# EAGLE design PiHatSandwich-v2 (EAGLE 7.4.0)
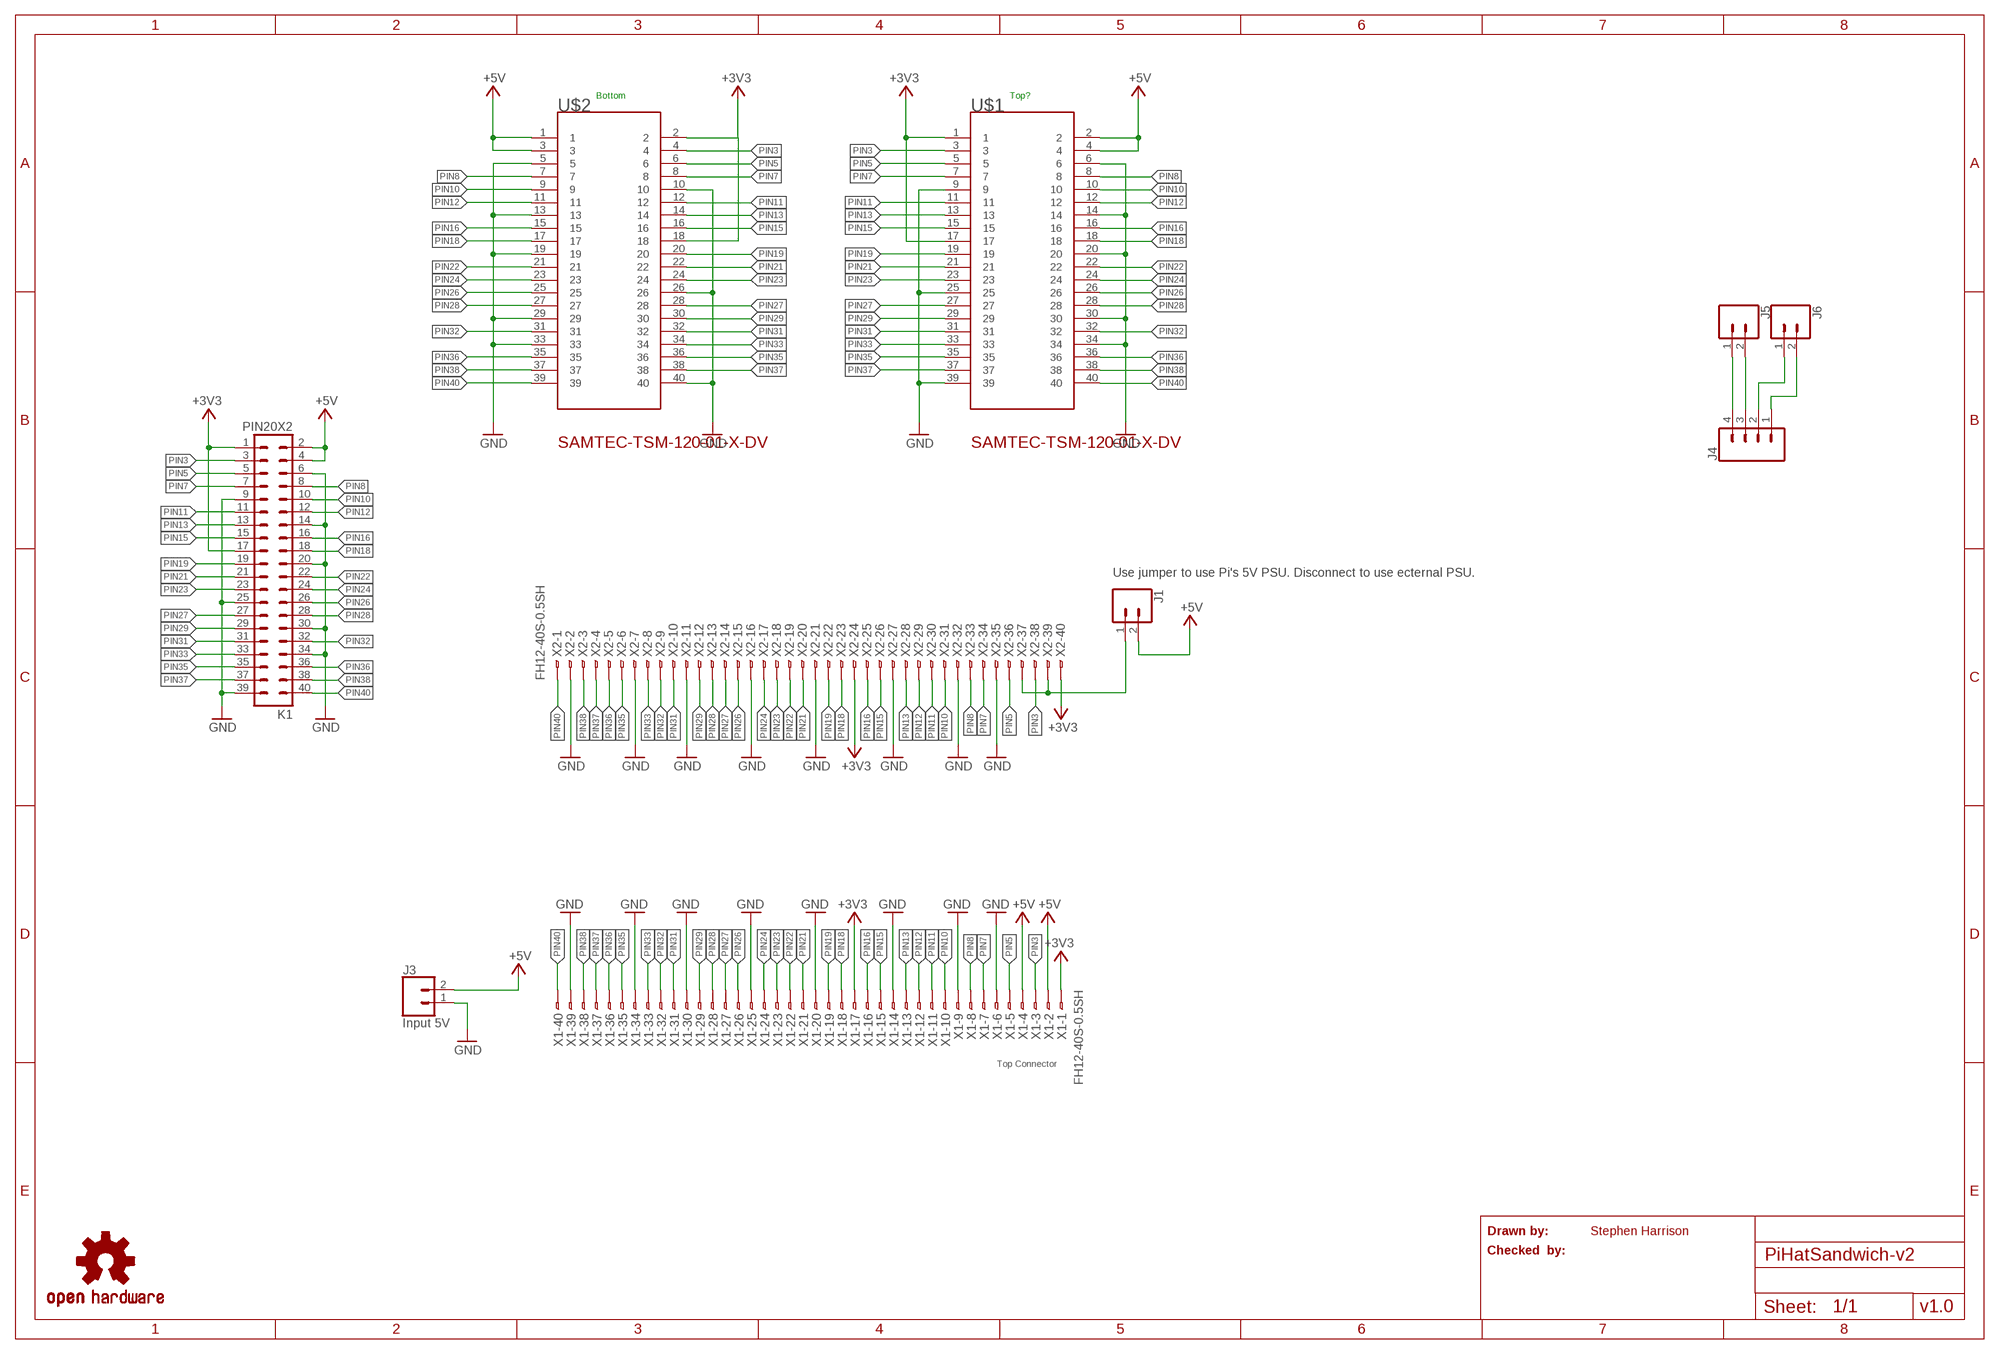
[diagram p0: schematic, sheet 1]

## Parts
J1  CONN_02  [1X02]
J3  Input 5V  CONN_02POLAR  [MOLEX-1X2]
J4  CONN_04POLAR  [MOLEX-1X4]
J5  CONN_02  [1X02]
J6  CONN_02  [1X02]
K1  PIN20X2  [PIN_20X2]
LOGO1  OSHW-LOGOL  [OSHW-LOGO-L]
U$1  SAMTEC-TSM-120-01-X-DVJ  [SAMTEC-TSM-120-01-X-DV]
U$2  SAMTEC-TSM-120-01-X-DVJ  [SAMTEC-TSM-120-01-X-DV]
X1  FH12-40S-0.5SH  [FH12-40S-0.5SH]
X2  FH12-40S-0.5SH  [FH12-40S-0.5SH]

## Nets
+3V3: K1.1 K1.17 U$1.1 U$1.17 U$2.2 U$2.18 X1.1 X1.17 X2.24 X2.40
+5V: J1.2 J3.2 K1.2 K1.4 U$1.2 U$1.4 U$2.1 U$2.3 X1.2 X1.4
GND: J3.1 K1.6 K1.9 K1.14 K1.20 K1.25 K1.30 K1.34 K1.39 U$1.6 U$1.9 U$1.14 U$1.20 U$1.25 U$1.30 U$1.34 U$1.39 U$2.5 U$2.10 U$2.13 U$2.19 U$2.26 U$2.29 U$2.33 U$2.40 X1.6 X1.9 X1.14 X1.20 X1.25 X1.30 X1.34 X1.39 X2.2 X2.7 X2.11 X2.16 X2.21 X2.27 X2.32 X2.35
N$2: J1.1 X2.37 X2.39
N$4: J4.4 J5.1
N$5: J4.3 J5.2
N$6: J4.1 J6.2
N$7: J4.2 J6.1
PIN3: K1.3 U$1.3 U$2.4 X1.3 X2.38
PIN5: K1.5 U$1.5 U$2.6 X1.5 X2.36
PIN7: K1.7 U$1.7 U$2.8 X1.7 X2.34
PIN8: K1.8 U$1.8 U$2.7 X1.8 X2.33
PIN10: K1.10 U$1.10 U$2.9 X1.10 X2.31
PIN11: K1.11 U$1.11 U$2.12 X1.11 X2.30
PIN12: K1.12 U$1.12 U$2.11 X1.12 X2.29
PIN13: K1.13 U$1.13 U$2.14 X1.13 X2.28
PIN15: K1.15 U$1.15 U$2.16 X1.15 X2.26
PIN16: K1.16 U$1.16 U$2.15 X1.16 X2.25
PIN18: K1.18 U$1.18 U$2.17 X1.18 X2.23
PIN19: K1.19 U$1.19 U$2.20 X1.19 X2.22
PIN21: K1.21 U$1.21 U$2.22 X1.21 X2.20
PIN22: K1.22 U$1.22 U$2.21 X1.22 X2.19
PIN23: K1.23 U$1.23 U$2.24 X1.23 X2.18
PIN24: K1.24 U$1.24 U$2.23 X1.24 X2.17
PIN26: K1.26 U$1.26 U$2.25 X1.26 X2.15
PIN27: K1.27 U$1.27 U$2.28 X1.27 X2.14
PIN28: K1.28 U$1.28 U$2.27 X1.28 X2.13
PIN29: K1.29 U$1.29 U$2.30 X1.29 X2.12
PIN31: K1.31 U$1.31 U$2.32 X1.31 X2.10
PIN32: K1.32 U$1.32 U$2.31 X1.32 X2.9
PIN33: K1.33 U$1.33 U$2.34 X1.33 X2.8
PIN35: K1.35 U$1.35 U$2.36 X1.35 X2.6
PIN36: K1.36 U$1.36 U$2.35 X1.36 X2.5
PIN37: K1.37 U$1.37 U$2.38 X1.37 X2.4
PIN38: K1.38 U$1.38 U$2.37 X1.38 X2.3
PIN40: K1.40 U$1.40 U$2.39 X1.40 X2.1

## Notes on the sheet
- Bottom | Top?
- Use jumper to use Pi's 5V PSU. Disconnect to use ecternal PSU.
- Top Connector
- Drawn by: | Stephen Harrison
- Checked  by:
- v1.0

## Library data of the parts
J1 J5 J6 = SparkFun-Connectors:CONN_02: Multi connection point. Often used as Generic Header-pin footprint for 0.1 inch spaced/style header connections On any of the 0.1 inch spaced packages, you can populate with these: Break Away Headers - Straight <https://www.sparkfun.com/products/116> (PRT-00116) Break Away Male Headers - Right Angle <https://www.sparkfun.com/products/553> (PRT-00553) Female Headers <https://www.sparkfun.com/products/115> (PRT-00115) Break Away Headers - Machine Pin <https://www.sparkfun.com/products/117> (PRT-00117) Break Away Female Headers - Swiss Machine Pin <https://www.sparkfun.com/products/743> (PRT-00743) For SCREWTERMINALS and SPRING TERMINALS visit here: Screw Terimnals on SparkFun.com <https://www.sparkfun.com/search/results?term=Screw+Terminals> (5mm/3.5mm/2.54mm spacing) This device is also useful as a general connection point to wire up your design to another part of your project. Our various solder wires solder well into these plated through hole pads. Hook-Up Wire - Assortment (Stranded, 22 AWG) <https://www.sparkfun.com/products/11375> (PRT-11375) Hook-Up Wire - Assortment (Solid Core, 22 AWG) <https://www.sparkfun.com/products/11367> (PRT-11367) View the entire wire category on our website here <https://www.sparkfun.com/categories/141> Special notes: Molex polarized connector foot print use with: PRT-08233 with associated crimp pins and housings. 2.54_SCREWTERM for use with PRT-10571. 3.5mm Screw Terminal footprints for PRT-08084 5mm Screw Terminal footprints for use with PRT-08432
J3 = SparkFun-Connectors:CONN_02: Multi connection point. Often used as Generic Header-pin footprint for 0.1 inch spaced/style header connections On any of the 0.1 inch spaced packages, you can populate with these: Break Away Headers - Straight <https://www.sparkfun.com/products/116> (PRT-00116) Break Away Male Headers - Right Angle <https://www.sparkfun.com/products/553> (PRT-00553) Female Headers <https://www.sparkfun.com/products/115> (PRT-00115) Break Away Headers - Machine Pin <https://www.sparkfun.com/products/117> (PRT-00117) Break Away Female Headers - Swiss Machine Pin <https://www.sparkfun.com/products/743> (PRT-00743) For SCREWTERMINALS and SPRING TERMINALS visit here: Screw Terimnals on SparkFun.com <https://www.sparkfun.com/search/results?term=Screw+Terminals> (5mm/3.5mm/2.54mm spacing) This device is also useful as a general connection point to wire up your design to another part of your project. Our various solder wires solder well into these plated through hole pads. Hook-Up Wire - Assortment (Stranded, 22 AWG) <https://www.sparkfun.com/products/11375> (PRT-11375) Hook-Up Wire - Assortment (Solid Core, 22 AWG) <https://www.sparkfun.com/products/11367> (PRT-11367) View the entire wire category on our website here <https://www.sparkfun.com/categories/141> Special notes: Molex polarized connector foot print use with: PRT-08233 with associated crimp pins and housings. 2.54_SCREWTERM for use with PRT-10571. 3.5mm Screw Terminal footprints for PRT-08084 5mm Screw Terminal footprints for use with PRT-08432; SF_ID: PRT-09918
J4 = SparkFun-Connectors:CONN_04: Multi connection point. Often used as Generic Header-pin footprint for 0.1 inch spaced/style header connections On any of the 0.1 inch spaced packages, you can populate with these: Break Away Headers - Straight <https://www.sparkfun.com/products/116> (PRT-00116) Break Away Male Headers - Right Angle <https://www.sparkfun.com/products/553> (PRT-00553) Female Headers <https://www.sparkfun.com/products/115> (PRT-00115) Break Away Headers - Machine Pin <https://www.sparkfun.com/products/117> (PRT-00117) Break Away Female Headers - Swiss Machine Pin <https://www.sparkfun.com/products/743> (PRT-00743) For SCREWTERMINALS and SPRING TERMINALS visit here: Screw Terimnals on SparkFun.com <https://www.sparkfun.com/search/results?term=Screw+Terminals> (5mm/3.5mm/2.54mm spacing) This device is also useful as a general connection point to wire up your design to another part of your project. Our various solder wires solder well into these plated through hole pads. Hook-Up Wire - Assortment (Stranded, 22 AWG) <https://www.sparkfun.com/products/11375> (PRT-11375) Hook-Up Wire - Assortment (Solid Core, 22 AWG) <https://www.sparkfun.com/products/11367> (PRT-11367) View the entire wire category on our website here <https://www.sparkfun.com/categories/141> Special notes: Molex polarized connector foot print use with SKU : PRT-08231 with associated crimp pins and housings. 1MM SMD Version SKU: PRT-10208; PROD_ID: CONN-08186; SF_ID: PRT-08231
K1 = FLYFISH:PIN20X2
LOGO1 = SparkFun-Aesthetics:OSHW-LOGO: Open-Source Hardware (OSHW) Logo This logo indicates the piece of hardware it is found on incorporates a OSHW license and/or adheres to the definition of open source hardware found here: http://freedomdefined.org/OSHW
U$1 U$2 = SAMTEC-TSM-120-01-X-DV:SAMTEC-TSM-120-01-X-DV; AVAILABILITY: Unavailable; DESCRIPTION: Conn Unshrouded Header HDR 40 POS 2.54mm Solder ST SMD Tube; MF: Samtec; MP: TSM-120-01-S-DV-M; PACKAGE: None; PRICE: None
X1 X2 = con-hirose:FH12-40S-0.5S: 0.5mm Pitch Connectors For FPC/FFC Source: Data sheet <http://www.hirose.co.jp/cataloge_hp/e58605370.pdf>; MPN: FH12-40S-0.5SH(55); OC_FARNELL: 1324556; OC_NEWARK: 34M6178

## Board
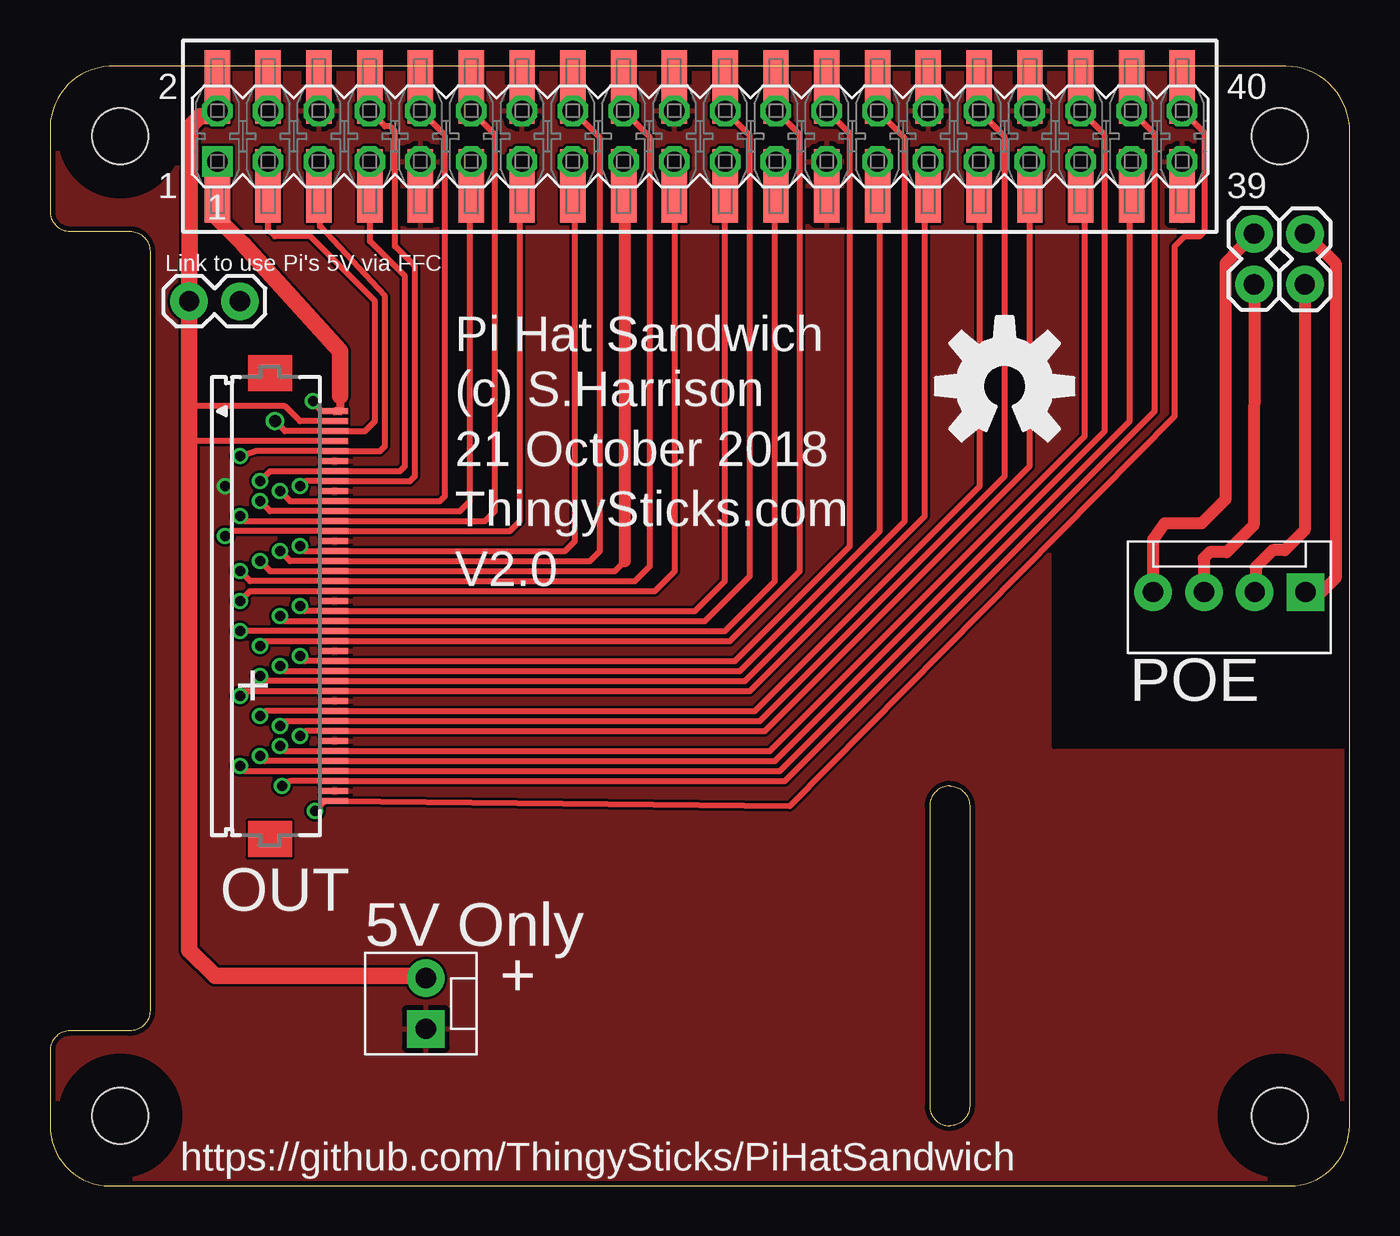
[diagram p1: board, top side]
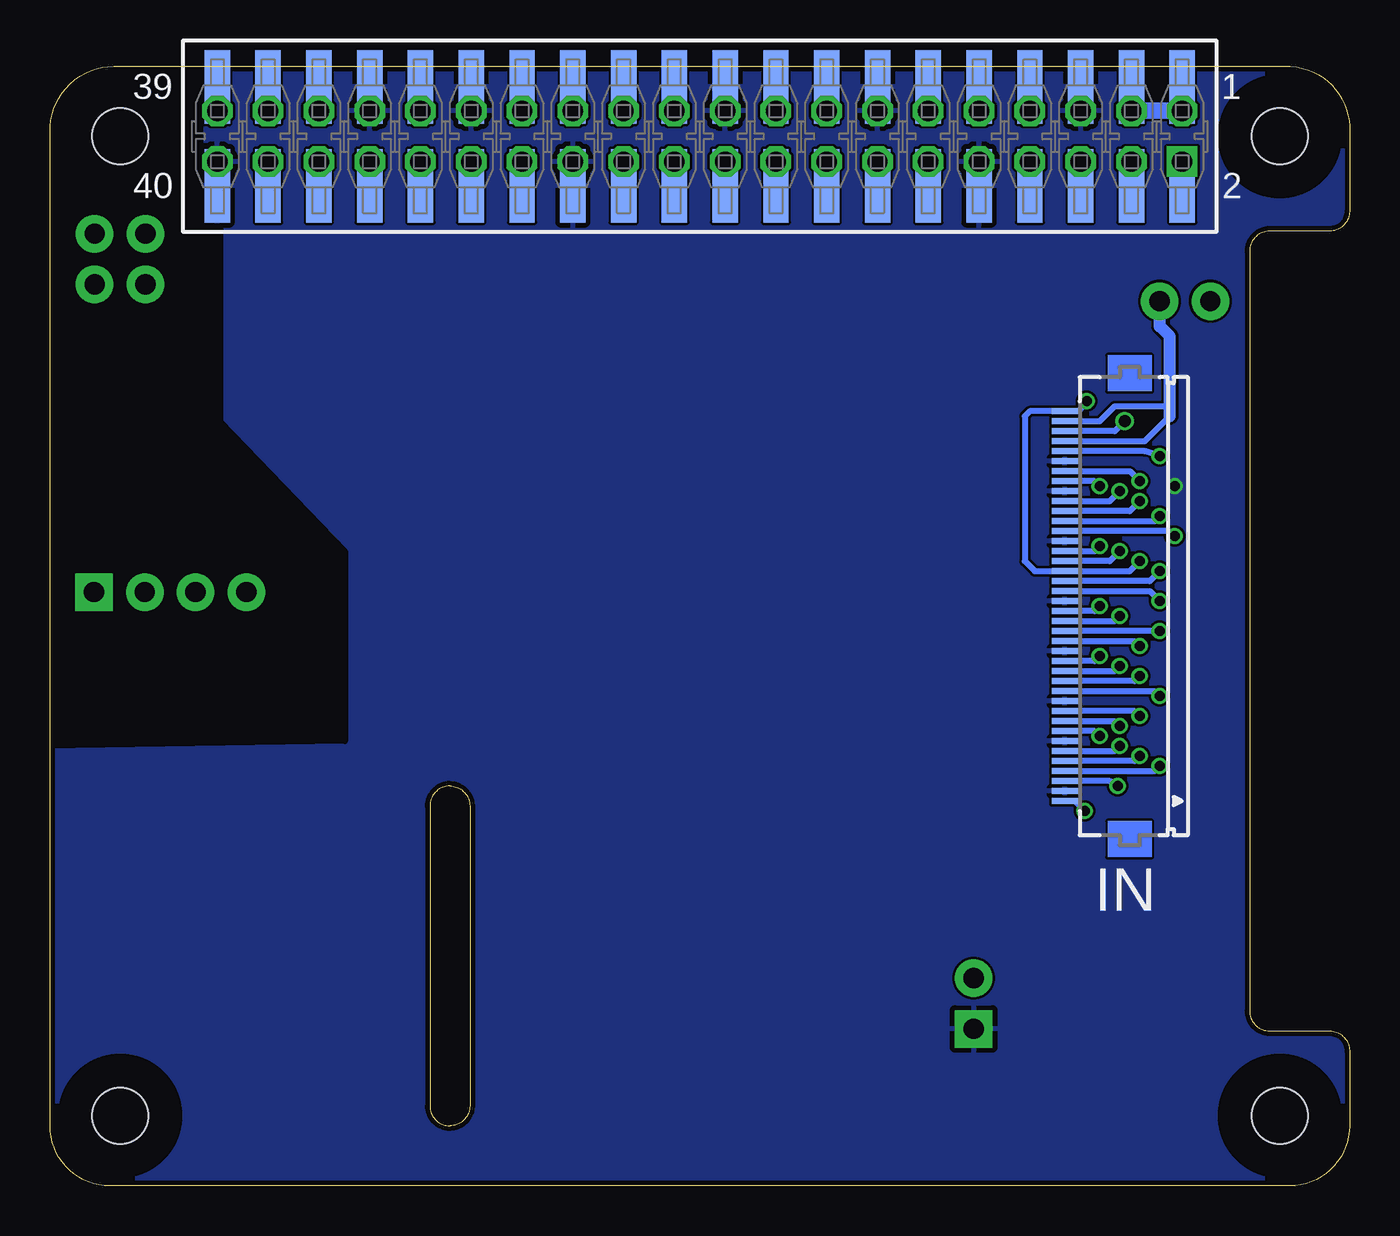
[diagram p2: board, bottom side, seen from below]

Size 65 x 56.01 mm. Coordinates in mm from the lower left corner, seen from the top.
Outline: 0,3 arc90 3,0 62,0 arc90 65,3 65,53 arc90 61.5,56 3.25,56 arc90 0,53 0,48.75 arc90 1,47.75 4,47.75 arc-90 5,46.75 5,8.75 arc-90 4,7.75 1,7.75 arc90 0,6.75 0,3
Outline: 44,19 44,4 arc90 45,3 arc90 46,4 46,19 arc90 45,20 arc90 44,19
Copper layers (1*16): Top 0.035mm / dielectric 1.5mm / Bottom 0.035mm
Design rules "dirt_cheap_dirty_boards.v1": minimum track width 5mil, minimum drill 12mil, track to track 5mil, track to pad 5mil, pad to pad 5mil, via to via 5mil, smd to smd 0mil, copper to edge 10mil, drill to drill 10mil, minimum pad ring 10mil, minimum via ring 6mil, stop-mask expansion 2mil, vias tented up to drill 25mil, thermal gap 10mil
Holes 2.8 mm at 3.5,3.5 3.5,52.5 61.5,52.5 61.5,3.5
tRestrict: area 1.9,51 to 5,54; area 60,51 to 63,54; area 60,1.9 to 63,5; area 1.9,1.9 to 5,5; area 50.2,22 to 65.2,56
bRestrict: area 1.9,1.9 to 5,5; area 1.9,51 to 5,54; area 60,1.9 to 63,5; area 60,51 to 63,54; area 50.2,22 to 65.2,56
Milling: 6 lines

### Footprints (pad centres in the part's own frame; a part is rotated, then mirrored left to right if it is on the bottom)
1X02 = drill 1.016 pad 1.88: 1 0,0; 2 2.54,0
MOLEX-1X2 = drill 1.016 pad 1.88 square: 1 0,0 | drill 1.016 pad 1.88: 2 2.54,0
MOLEX-1X4 = drill 1.016 pad 1.88 square: 1 0,0 | drill 1.016 pad 1.88: 2 2.54,0; 3 5.08,0; 4 7.62,0
PIN_20X2 = drill 1.016 square: 1 -24.13,-1.27 | drill 1.016 octagon: 2 -24.13,1.27; 3 -21.59,-1.27; 4 -21.59,1.27; 5 -19.05,-1.27; 6 -19.05,1.27; 7 -16.51,-1.27; 8 -16.51,1.27; 9 -13.97,-1.27; 10 -13.97,1.27; 11 -11.43,-1.27; 12 -11.43,1.27; 13 -8.89,-1.27; 14 -8.89,1.27; 15 -6.35,-1.27; 16 -6.35,1.27; 17 -3.81,-1.27; 18 -3.81,1.27; 19 -1.27,-1.27; 20 -1.27,1.27; 21 1.27,-1.27; 22 1.27,1.27; 23 3.81,-1.27; 24 3.81,1.27; 25 6.35,-1.27; 26 6.35,1.27; 27 8.89,-1.27; 28 8.89,1.27; 29 11.43,-1.27; 30 11.43,1.27; 31 13.97,-1.27; 32 13.97,1.27; 33 16.51,-1.27; 34 16.51,1.27; 35 19.05,-1.27; 36 19.05,1.27; 37 21.59,-1.27; 38 21.59,1.27; 39 24.13,-1.27; 40 24.13,1.27
SAMTEC-TSM-120-01-X-DV = smd 1.27 x 3.68: 1 -24.13,-2.476; 2 -24.13,2.476; 3 -21.59,-2.476; 4 -21.59,2.476; 5 -19.05,-2.476; 6 -19.05,2.476; 7 -16.51,-2.476; 8 -16.51,2.476; 9 -13.97,-2.476; 10 -13.97,2.476; 11 -11.43,-2.476; 12 -11.43,2.476; 13 -8.89,-2.476; 14 -8.89,2.476; 15 -6.35,-2.476; 16 -6.35,2.476; 17 -3.81,-2.476; 18 -3.81,2.476; 19 -1.27,-2.476; 20 -1.27,2.476; 21 1.27,-2.476; 22 1.27,2.476; 23 3.81,-2.476; 24 3.81,2.476; 25 6.35,-2.476; 26 6.35,2.476; 27 8.89,-2.476; 28 8.89,2.476; 29 11.43,-2.476; 30 11.43,2.476; 31 13.97,-2.476; 32 13.97,2.476; 33 16.51,-2.476; 34 16.51,2.476; 35 19.05,-2.476; 36 19.05,2.476; 37 21.59,-2.476; 38 21.59,2.476; 39 24.13,-2.476; 40 24.13,2.476
FH12-40S-0.5SH = smd 0.3 x 1.3: 1 -9.75,3.25; 2 -9.25,3.25; 3 -8.75,3.25; 4 -8.25,3.25; 5 -7.75,3.25; 6 -7.25,3.25; 7 -6.75,3.25; 8 -6.25,3.25; 9 -5.75,3.25; 10 -5.25,3.25; 11 -4.75,3.25; 12 -4.25,3.25; 13 -3.75,3.25; 14 -3.25,3.25; 15 -2.75,3.25; 16 -2.25,3.25; 17 -1.75,3.25; 18 -1.25,3.25; 19 -0.75,3.25; 20 -0.25,3.25; 21 0.25,3.25; 22 0.75,3.25; 23 1.25,3.25; 24 1.75,3.25; 25 2.25,3.25; 26 2.75,3.25; 27 3.25,3.25; 28 3.75,3.25; 29 4.25,3.25; 30 4.75,3.25; 31 5.25,3.25; 32 5.75,3.25; 33 6.25,3.25; 34 6.75,3.25; 35 7.25,3.25; 36 7.75,3.25; 37 8.25,3.25; 38 8.75,3.25; 39 9.25,3.25; 40 9.75,3.25

### Placement (x,y rotation side)
J1  9.5,44.25 180 top
J3  18.8,7.85 90 top
J4  62.8,29.7 180 top
J5  60.23,47.62 270 top
J6  62.77,45.09 90 top
K1  32.5,52.5 0 top
LOGO1  47.75,40 0 top
U$1  32.5,52.5 0 top
U$2  32.5,52.5 180 bottom
X1  11,29 270 top
X2  11,29 90 bottom

### Tracks (layer width: path | path; a pad name or v marks a point on that pad's centre or on a via)
+3V3  (via drill 0.5)
  Top 0.254: K1.1 8.4,51.23
  Top 0.305: X2.40 13.55,38.75 v13.15,39.25 | 8.25,51.11 8.25,50.14 U$2.2 | v10.5,31.25 11,30.75 X1.17 28.25,30.75 28.75,31.25 | 28.75,51.17 K1.17
  Top 0.406: 14.5,39.5 14.5,38.75 X2.40
  Top 0.61: K1.17 U$2.18 | 28.75,31.25 28.75,51.17
  Top 0.813: 8.25,51.11 K1.1 | 14.5,39.5 14.5,41.75 9.62,47.12 8.25,48.5 8.37,48.62 U$2.2
  Bottom 0.305: v13.15,39.25 13.55,38.75 X2.40 16,38.75 16.25,38.5 16.25,31.25 15.75,30.75 X1.17 11,30.75 v10.5,31.25
  Bottom 0.813: U$2.2 K1.1 | U$2.18 K1.17
+5V
  Top 0.305: K1.4 U$2.3 | K1.2 U$2.1 | X1.4 7.25,37.25 6.96,37.54 6.96,39 | 6.96,39 J1.2 | X1.2 12.5,38.25 11.75,39 6.96,39
  Top 0.813: 8.35,53.75 K1.2 8.1,53.5 7.5,53.5 7,53 J1.2 6.96,11.79 8.25,10.5 18.69,10.5 J3.2
  Bottom 0.813: U$2.1 K1.2 K1.4 U$2.3
GND  (via drill 0.5)
  other vias: 8.75,35
  pour Bottom: 0,3 arc90 3,0 62,0 arc90 65,3 65,53 arc90 61.5,56 3,56 arc90 0,53 0,48.75 arc90 1,47.75 4,47.75 arc-90 5,46.75 5,8.75 arc-90 4,7.75 1,7.75 arc90 0,6.75
  pour Top: 0,3 arc90 3,0 62,0 arc90 65,3 65,53 arc90 62,56 3,56 arc90 0,53 0,48.75 arc90 1,47.75 4,47.75 arc-90 5,46.75 5,8.75 arc-90 4,7.75 1,7.75 arc90 0,6.75
N$2
  Bottom 0.305: X2.39 12.5,38.25 11.75,39 9,39 | X2.37 10.25,37.25 9,38.5
  Bottom 0.61: 9,38.5 9,39 9,42.5 9.5,43 J1.1
N$4
  Top 0.61: J4.4 55.18,32.33 55.75,33.15 57.6,33.15 58.8,34.35 58.8,46.15 J5.1
N$5
  Top 0.61: J5.2 60.2,33.05 58.85,31.7 58,31.7 57.7,31.4 57.7,29.72 J4.3
N$6
  Top 0.61: J4.1 63.6,29.7 64.3,30.4 64.3,46.15 63.26,47.19 J6.2
N$7
  Top 0.61: J6.1 62.75,32.8 61.75,31.8 61.15,31.8 60.3,30.95 60.3,29.74 J4.2
PIN3  (via drill 0.6)
  Top 0.254: K1.3
  Top 0.305: 11,51.14 K1.3 | U$2.4 10.91,47.84 11.25,47.5 13,47.5 16.25,44.25 16.25,38.25 15.75,37.75 X2.38 11.75,37.75 v11.25,38.25
  Top 0.813: U$2.4 11,50.11 | 11,51.14 10.91,51.05 U$2.4 | U$2.4 K1.3
  Bottom 0.305: v11.25,38.25 11.75,37.75 X2.38
  Bottom 0.813: U$2.4 K1.3
PIN5  (via drill 0.5)
  Top 0.254: U$2.6 K1.5
  Top 0.305: v9.5,36.5 10.25,36.75 X2.36 16.5,36.75 16.75,37 16.75,44.5 13.5,48 13.5,51.18 K1.5 | U$2.6 13.45,50.95
  Bottom 0.305: v9.5,36.5 10.25,36.75 X2.36 | 13.5,50.07 U$2.6
  Bottom 0.813: U$2.6 K1.5
PIN7  (via drill 0.5)
  Top 0.254: U$2.8 K1.7
  Top 0.305: v10.5,35.25 11,35.75 X2.34 17.5,35.75 17.75,36 17.75,45.5 16,47.25 K1.7
  Bottom 0.305: X2.34 11,35.75 v10.5,35.25
  Bottom 0.813: U$2.8 K1.7
PIN8  (via drill 0.5)
  Top 0.305: U$2.7 K1.8 16.76,53 17,53 17.25,52.75 17.25,47 18.25,46 18.25,35.5 18,35.25 X2.33 12.75,35.25 v12.5,35
  Bottom 0.305: v12.5,35 12.75,35.25 X2.33
  Bottom 0.813: U$2.7 K1.8
PIN10  (via drill 0.5)
  Top 0.305: U$2.9 K1.10 19.75,52.55 19.75,34.5 19.5,34.25 X2.31 12,34.25 v11.5,34.75
  Bottom 0.305: X2.31 12,34.25 v11.5,34.75
  Bottom 0.813: U$2.9 K1.10
PIN11  (via drill 0.5)
  Top 0.254: U$2.12 K1.11
  Top 0.305: 21.1,51.2 K1.11 21,51.16 21,34.25 20.5,33.75 X2.30 11,33.75 v10.5,34.25
  Bottom 0.305: v10.5,34.25 11,33.75 X2.30
  Bottom 0.813: U$2.12 K1.11
PIN12  (via drill 0.5)
  Top 0.305: U$2.11 K1.12 22.25,52.59 22.25,33.75 21.75,33.25 X2.29 9.75,33.25 v9.5,33.5
  Bottom 0.305: X2.29 9.75,33.25 v9.5,33.5
  Bottom 0.813: U$2.11 K1.12
PIN13  (via drill 0.5)
  Top 0.254: U$2.14 K1.13
  Top 0.305: v8.75,32.5 9,32.75 X2.28 23,32.75 23.5,33.25 23.5,51.12 K1.13
  Bottom 0.254: U$2.14 K1.13
  Bottom 0.305: v8.75,32.5 9,32.75 X2.28
PIN15  (via drill 0.5)
  Top 0.254: U$2.16 K1.15
  Top 0.305: 26.1,51.18 K1.15 | v12.5,32 12.75,31.75 X1.15 25.75,31.75 26.25,32.25 26.25,49.92 U$2.16
  Bottom 0.305: X1.15 12.75,31.75 v12.5,32
  Bottom 0.813: U$2.16 K1.15
PIN16  (via drill 0.5)
  Top 0.305: U$2.15 K1.16 27.5,52.42 27.5,31.75 27,31.25 X1.16 12,31.25 v11.5,31.75
  Bottom 0.305: v11.5,31.75 12,31.25 X1.16
  Bottom 0.813: U$2.15 K1.16
PIN18  (via drill 0.5)
  Top 0.305: U$2.17 K1.18 30,52.46 30,31 29.25,30.25 X1.18 10,30.25 v9.5,30.75
  Bottom 0.305: v9.5,30.75 10,30.25 X1.18
  Bottom 0.813: U$2.17 K1.18
PIN19  (via drill 0.5)
  Top 0.254: U$2.20 K1.19
  Top 0.305: v9.5,29.25 10,29.75 X1.19 30.25,29.75 31.25,30.75 31.25,51.21 K1.19
  Bottom 0.305: X1.19 10,29.75 v9.5,29.25
  Bottom 0.813: U$2.20 K1.19
PIN21  (via drill 0.5)
  Top 0.254: U$2.22 K1.21
  Top 0.305: v12.5,29 12.75,28.75 X1.21 32.25,28.75 33.75,30.25 33.75,51.21 K1.21
  Bottom 0.305: v12.5,29 12.75,28.75 X1.21
  Bottom 0.813: U$2.22 K1.21
PIN22  (via drill 0.5)
  Top 0.305: U$2.21 K1.22 35,52.54 35,30.5 32.75,28.25 X1.22 11.75,28.25 v11.5,28.5
  Bottom 0.305: X1.22 11.75,28.25 v11.5,28.5
  Bottom 0.813: U$2.21 K1.22
PIN23  (via drill 0.5)
  Top 0.254: U$2.24 K1.23
  Top 0.305: v9.5,27.75 X1.23 33.75,27.75 36.25,30.25 36.25,51.17 K1.23
  Bottom 0.305: v9.5,27.75 X1.23
  Bottom 0.813: U$2.24 K1.23
PIN24  (via drill 0.5)
  Top 0.305: U$2.23 K1.24 37.5,52.58 37.5,30.75 34,27.25 X1.24 10.75,27.25 v10.5,27
  Bottom 0.305: X1.24 10.75,27.25 v10.5,27
  Bottom 0.813: U$2.23 K1.24
PIN26  (via drill 0.5)
  Top 0.305: U$2.25 K1.26 40,52.62 40,32 34.25,26.25 X1.26 12.75,26.25 v12.5,26.5
  Bottom 0.305: v12.5,26.5 12.75,26.25 X1.26
  Bottom 0.813: U$2.25 K1.26
PIN27  (via drill 0.5)
  Top 0.254: U$2.28 K1.27
  Top 0.305: v11.5,26 11.75,25.75 X1.27 34.5,25.75 41.5,32.75 41.5,51.12 K1.27
  Bottom 0.305: X1.27 11.75,25.75 v11.5,26
  Bottom 0.813: U$2.28 K1.27
PIN28  (via drill 0.5)
  Top 0.305: U$2.27 K1.28 42.75,52.41 42.75,33.25 34.75,25.25 X1.28 10.75,25.25 v10.5,25.5
  Bottom 0.305: v10.5,25.5 10.75,25.25 X1.28
  Bottom 0.813: U$2.27 K1.28
PIN29  (via drill 0.5)
  Top 0.254: U$2.30 K1.29
  Top 0.305: v9.5,24.5 9.75,24.75 X1.29 35,24.75 43.75,33.5 43.75,51.05 K1.29
  Bottom 0.305: X1.29 9.75,24.75 v9.5,24.5
  Bottom 0.813: U$2.30 K1.29
PIN31  (via drill 0.5)
  Top 0.254: U$2.32 K1.31
  Top 0.305: v10.5,23.5 10.75,23.75 X1.31 35.25,23.75 46.5,35 46.5,51.2 K1.31
  Bottom 0.305: v10.5,23.5 10.75,23.75 X1.31
  Bottom 0.813: U$2.32 K1.31
PIN32  (via drill 0.5)
  Top 0.305: U$2.31 K1.32 47.75,52.49 47.75,35.5 35.5,23.25 X1.32 11.75,23.25 v11.5,23
  Bottom 0.305: X1.32 11.75,23.25 v11.5,23
  Bottom 0.813: U$2.31 K1.32
PIN33  (via drill 0.5)
  Top 0.254: U$2.34 K1.33
  Top 0.305: v12.5,22.5 12.75,22.75 X1.33 35.75,22.75 49,36 K1.33
  Bottom 0.305: v12.5,22.5 12.75,22.75 X1.33
  Bottom 0.813: U$2.34 K1.33
PIN35  (via drill 0.5)
  Top 0.254: U$2.36 K1.35
  Top 0.305: v11.5,22 11.75,21.75 X1.35 36,21.75 51.75,37.5 51.75,51.03 K1.35
  Bottom 0.305: X1.35 11.75,21.75 v11.5,22
  Bottom 0.813: U$2.36 K1.35
PIN36  (via drill 0.5)
  Top 0.305: U$2.35 K1.36 52.75,52.57 52.75,37.75 36.25,21.25 X1.36 10.75,21.25 v10.5,21.5
  Bottom 0.305: v10.5,21.5 10.75,21.25 X1.36
  Bottom 0.813: U$2.35 K1.36
PIN37  (via drill 0.5)
  Top 0.254: 54,49 54.09,49.09 U$2.38 54,50.11 54,50.75 54,51.25 54.07,51.25 K1.37
  Top 0.305: v9.5,21 9.75,20.75 X1.37 36.5,20.75 54,38.25 54,49 54,50.75 54,51.14 | U$2.38 54.09,51.16 54,51.25
  Bottom 0.305: X1.37 9.75,20.75 v9.5,21 | 54,51.25 54,50.11 U$2.38
  Bottom 0.813: U$2.38 K1.37
PIN38  (via drill 0.5)
  Top 0.305: U$2.37 K1.38 55.25,52.61 55.25,38.75 36.75,20.25 X1.38 12,20.25 v11.6,20
  Bottom 0.305: v11.6,20 12,20.25 X1.38
  Bottom 0.813: U$2.37 K1.38
PIN40  (via drill 0.5)
  Top 0.305: U$2.39 K1.40 57.75,52.65 57.75,47.75 57.5,47.5 56.75,47.5 56.25,47 56.25,38.5 37,19 X1.40 13.75,19.25 v13.25,18.75
  Bottom 0.305: X1.40 13.75,19.25 v13.25,18.75
  Bottom 0.813: U$2.39 K1.40

### Text on the board
tNames: Link to use Pi's 5V via FFC | Pi Hat Sandwich | (c) S.Harrison | 21 October 2018 | ThingySticks.com | V2.0 | + | POE | OUT | 5V Only | + | https://github.com/ThingySticks/PiHatSandwich
bNames: IN